# EAGLE design 5key_macropad (EAGLE 7.7.0)
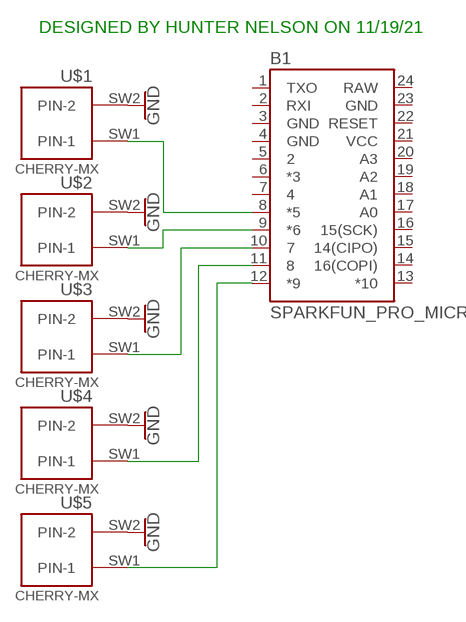
[diagram p0: schematic, sheet 1]

## Parts
B1  SPARKFUN_PRO_MICRO  [SPARKFUN_PRO_MICRO]
U$1  CHERRY-MX  [CHERRY-MX]
U$2  CHERRY-MX  [CHERRY-MX]
U$3  CHERRY-MX  [CHERRY-MX]
U$4  CHERRY-MX  [CHERRY-MX]
U$5  CHERRY-MX  [CHERRY-MX]

## Nets
GND: U$1.SW2(PIN-2) U$2.SW2(PIN-2) U$3.SW2(PIN-2) U$4.SW2(PIN-2) U$5.SW2(PIN-2)
N$1: B1.12(*9) U$5.SW1(PIN-1)
N$2: B1.11 U$4.SW1(PIN-1)
N$3: B1.10 U$3.SW1(PIN-1)
N$4: B1.9(*6) U$2.SW1(PIN-1)
N$5: B1.8(*5) U$1.SW1(PIN-1)
Unconnected: B1.1(TXO) B1.2(RXI) B1.5 B1.6(*3) B1.7 B1.13(*10) B1.14(16(COPI)) B1.15(14(CIPO)) B1.16(15(SCK)) B1.17(A0) B1.18(A1) B1.19(A2) B1.20(A3) B1.22(RESET)

## Notes on the sheet
- DESIGNED BY HUNTER NELSON ON 11/19/21

## Power pins joined to a net without a drawn wire
GND: B1.3(GND) B1.4(GND) B1.23(GND)
RAW: B1.24(RAW)
VCC: B1.21(VCC)

## Library data of the parts
B1 = SparkFun-Boards:SPARKFUN_PRO_MICRO: SparkFun Pro Micro Atmega32U4 compatible footprint. SparkFun Products: 3.3V/8MHz <https://www.sparkfun.com/products/12587> 5V/16MHz <https://www.sparkfun.com/products/12640>
U$1-U$5 = cherrymx:CHERRY-MX: Cherry MX series keyswitch

## Board
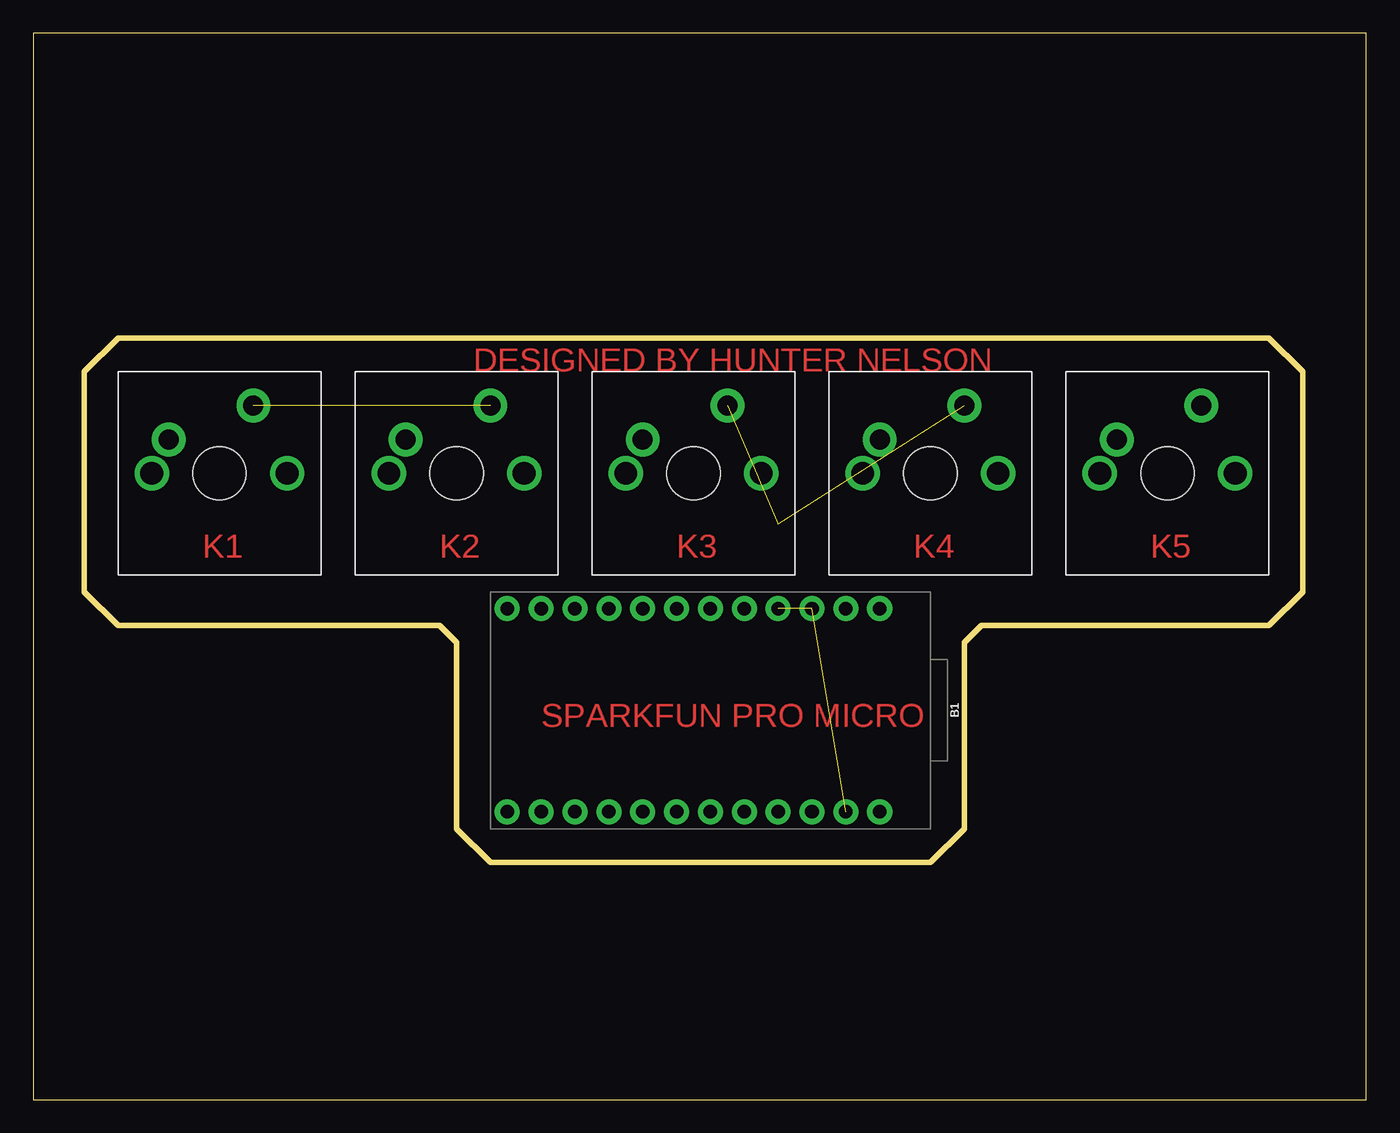
[diagram p1: board, top side]
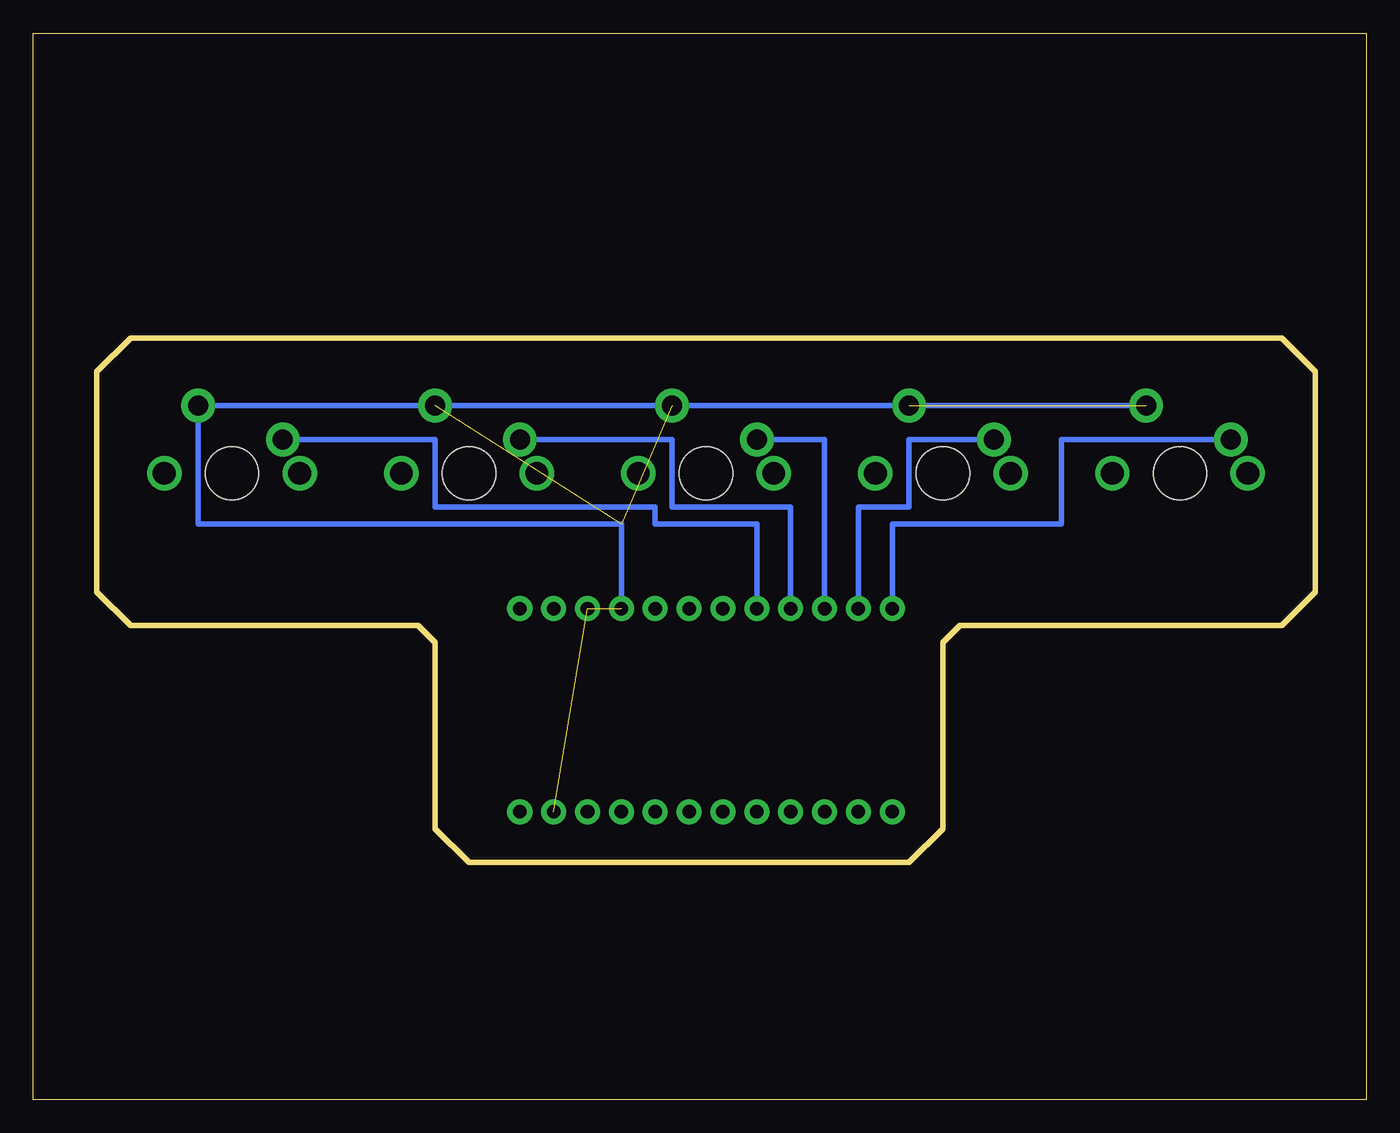
[diagram p2: board, bottom side, seen from below]

Size 100 x 80 mm. Coordinates in mm from the lower left corner, seen from the top.
Outline: 0,0 100,0 100,80 0,80 0,0
Outline: 3.81,54.61 3.81,38.1 6.35,35.56 30.48,35.56 31.75,34.29 31.75,20.32 34.29,17.78 67.31,17.78 69.85,20.32 69.85,34.29 71.12,35.56 92.71,35.56 95.25,38.1 95.25,54.61 92.71,57.15 6.35,57.15 3.81,54.61
Copper layers (1*16): Top 0.035mm / dielectric 1.5mm / Bottom 0.035mm
Design rules "default": minimum track width 10mil, minimum drill 24mil, track to track 8mil, track to pad 8mil, pad to pad 8mil, via to via 8mil, smd to smd 8mil, copper to edge 40mil, drill to drill 8mil, minimum pad ring 10mil, minimum via ring 8mil, stop-mask expansion 4mil, vias tented up to drill 0mil, thermal gap 10mil

### Footprints (pad centres in the part's own frame; a part is rotated, then mirrored left to right if it is on the bottom)
SPARKFUN_PRO_MICRO = drill 1.016 pad 1.88: 1 -7.62,12.7; 2 -7.62,10.16; 3 -7.62,7.62; 4 -7.62,5.08; 5 -7.62,2.54; 6 -7.62,0; 7 -7.62,-2.54; 8 -7.62,-5.08; 9 -7.62,-7.62; 10 -7.62,-10.16; 11 -7.62,-12.7; 12 -7.62,-15.24; 13 7.62,-15.24; 14 7.62,-12.7; 15 7.62,-10.16; 16 7.62,-7.62; 17 7.62,-5.08; 18 7.62,-2.54; 19 7.62,0; 20 7.62,2.54; 21 7.62,5.08; 22 7.62,7.62; 23 7.62,10.16; 24 7.62,12.7
CHERRY-MX = drill 1.714 pad 1.93: P$3 -5.08,0; P$4 5.08,0 | drill 1.5 pad 2.54: SW1 -3.81,2.54; SW2 2.54,5.08 | hole 4: 0,0

### Placement (x,y rotation side)
B1  50.8,29.21 270 top
U$1  85.09,46.99 0 top
U$2  67.31,46.99 0 top
U$3  49.53,46.99 0 top
U$4  31.75,46.99 0 top
U$5  13.97,46.99 0 top

### Tracks (layer width: path | path; a pad name or v marks a point on that pad's centre or on a via)
GND  (5 unrouted)
  Bottom 0.406: U$5.SW2 U$1.SW2 87.63,43.18 55.88,43.18 B1.4
N$1
  Bottom 0.406: U$5.SW1 22.86,49.53 22.86,43.18 35.56,43.18 B1.12
N$2
  Bottom 0.406: U$4.SW1 34.29,49.53 34.29,44.45 38.1,44.45 B1.11
N$3
  Bottom 0.406: U$3.SW1 40.64,49.53 B1.10
N$4
  Bottom 0.406: U$2.SW1 52.07,49.53 52.07,44.45 43.18,44.45 B1.9
N$5
  Bottom 0.406: U$1.SW1 69.85,49.53 69.85,44.45 53.34,44.45 53.34,43.18 45.72,43.18 B1.8

### Text on the board
Top: DESIGNED BY HUNTER NELSON | K1 | K2 | K3 | K4 | K5 | SPARKFUN PRO MICRO